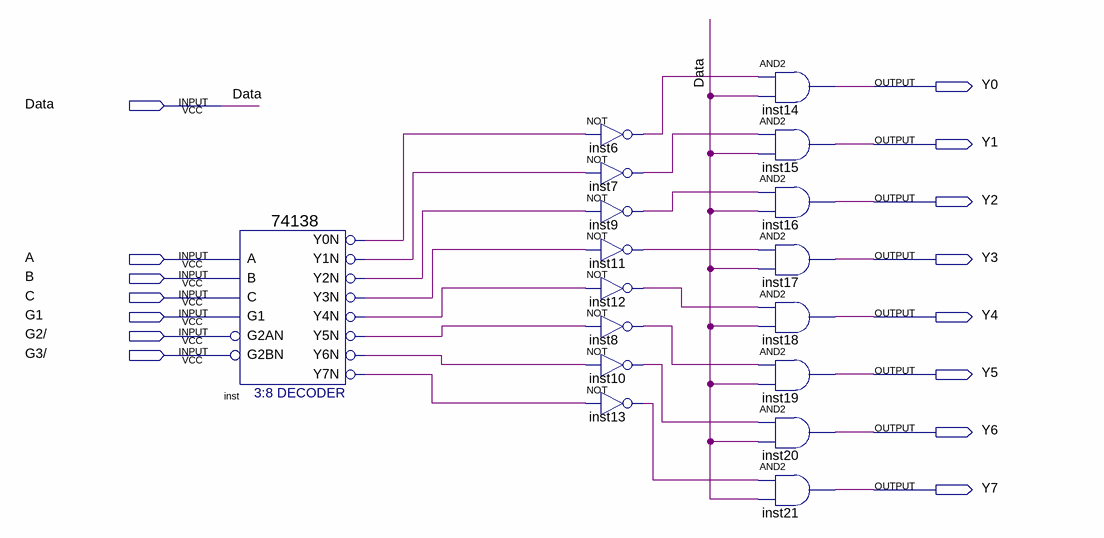
[diagram p0: schematic sheet]
// Quartus schematic 74138forMulti.bdf as structural Verilog: 17 symbols, 15 pins
module \74138forMulti  (
  input  Data,
  input  A,
  input  B,
  input  C,
  input  G1,
  input  \G2/ ,
  input  \G3/ ,
  output Y0,
  output Y1,
  output Y2,
  output Y3,
  output Y4,
  output Y5,
  output Y6,
  output Y7
);

  wire inst6_out, inst7_out, inst8_out, inst9_out, inst10_out, inst11_out, inst12_out, inst13_out, inst_y0n,
       inst_y1n, inst_y2n, inst_y3n, inst_y4n, inst_y5n, inst_y6n, inst_y7n;

  \74138  inst (
    .A(A), .B(B), .G1(G1), .C(C), .G2AN(\G2/ ), .G2BN(\G3/ ), .Y0N(inst_y0n), .Y1N(inst_y1n), .Y2N(inst_y2n),
    .Y3N(inst_y3n), .Y4N(inst_y4n), .Y5N(inst_y5n), .Y6N(inst_y6n), .Y7N(inst_y7n));
  not inst6 (inst6_out, inst_y0n);
  not inst7 (inst7_out, inst_y1n);
  not inst9 (inst9_out, inst_y2n);
  not inst11 (inst11_out, inst_y3n);
  not inst12 (inst12_out, inst_y4n);
  not inst8 (inst8_out, inst_y5n);
  not inst10 (inst10_out, inst_y6n);
  not inst13 (inst13_out, inst_y7n);
  and inst14 (Y0, inst6_out, Data);
  and inst15 (Y1, inst7_out, Data);
  and inst16 (Y2, inst9_out, Data);
  and inst17 (Y3, inst11_out, Data);
  and inst18 (Y4, inst12_out, Data);
  and inst19 (Y5, inst8_out, Data);
  and inst20 (Y6, inst10_out, Data);
  and inst21 (Y7, inst13_out, Data);
endmodule
